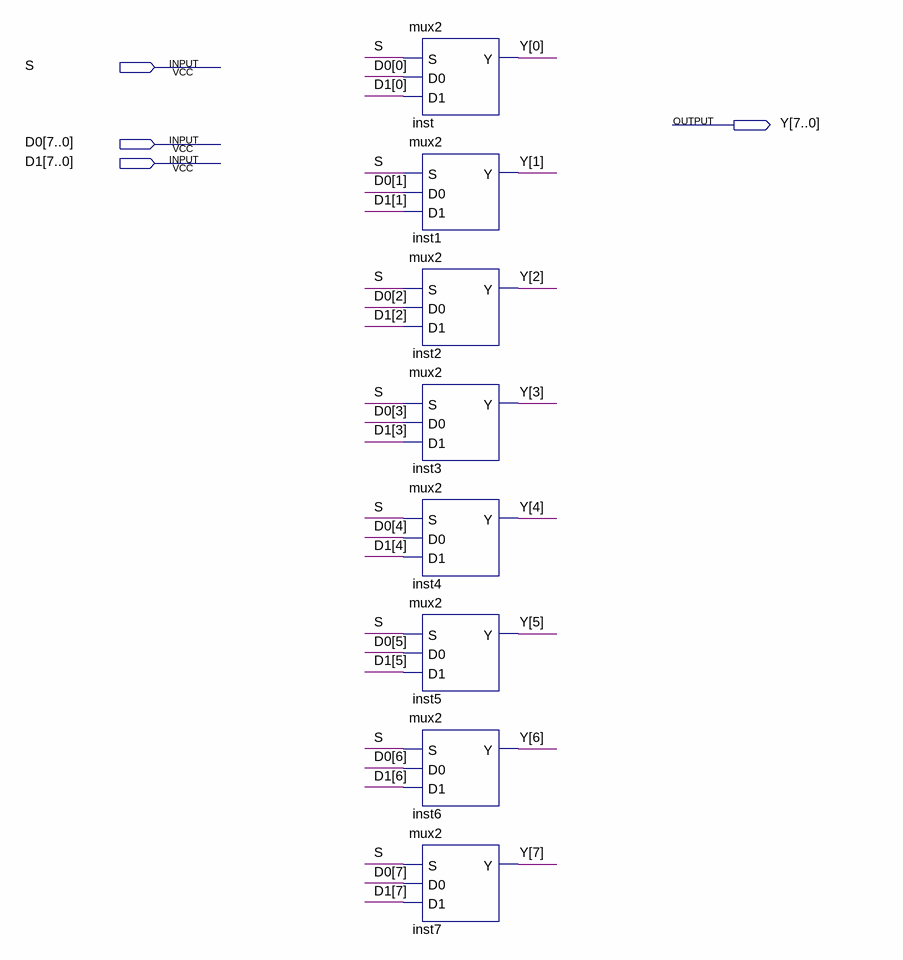
[diagram p0: schematic sheet]
// Quartus schematic mux2_8.bdf as structural Verilog: 8 symbols, 4 pins
module mux2_8 (
  input  S,
  input  [7:0] D0,
  input  [7:0] D1,
  output [7:0] Y
);

  mux2 inst (.S(S), .D0(D0[0]), .D1(D1[0]), .Y(Y[0]));
  mux2 inst1 (.S(S), .D0(D0[1]), .D1(D1[1]), .Y(Y[1]));
  mux2 inst2 (.S(S), .D0(D0[2]), .D1(D1[2]), .Y(Y[2]));
  mux2 inst3 (.S(S), .D0(D0[3]), .D1(D1[3]), .Y(Y[3]));
  mux2 inst4 (.S(S), .D0(D0[4]), .D1(D1[4]), .Y(Y[4]));
  mux2 inst5 (.S(S), .D0(D0[5]), .D1(D1[5]), .Y(Y[5]));
  mux2 inst6 (.S(S), .D0(D0[6]), .D1(D1[6]), .Y(Y[6]));
  mux2 inst7 (.S(S), .D0(D0[7]), .D1(D1[7]), .Y(Y[7]));
endmodule
